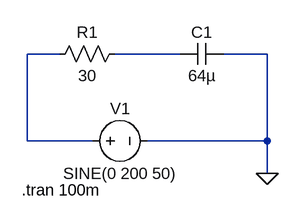
[diagram p0: schematic RC_AC Transients.asc]
RC_AC Transients.asc, the LTspice schematic file:
Version 4.1
SHEET 1 880 680
WIRE 128 144 80 144
WIRE 304 144 208 144
WIRE 432 144 368 144
WIRE 80 272 80 144
WIRE 176 272 80 272
WIRE 432 272 432 144
WIRE 432 272 256 272
WIRE 432 320 432 272
FLAG 432 320 0
SYMBOL res 112 160 R270
WINDOW 0 32 56 VTop 2
WINDOW 3 0 56 VBottom 2
SYMATTR InstName R1
SYMATTR Value 30
SYMBOL cap 368 128 R90
WINDOW 0 0 32 VBottom 2
WINDOW 3 32 32 VTop 2
SYMATTR InstName C1
SYMATTR Value 64µ
SYMBOL voltage 160 272 R270
WINDOW 0 32 56 VTop 2
WINDOW 3 -32 56 VBottom 2
WINDOW 123 0 0 Left 0
WINDOW 39 0 0 Left 0
SYMATTR InstName V1
SYMATTR Value SINE(0 200 50)
TEXT 72 344 Left 2 !.tran 100m

The netlist it stands for:
* RC_AC Transients.asc
R1 N001 N002 30
C1 0 N002 64µ
V1 N001 0 SINE(0 200 50)
.tran 100m
.backanno
.end